# Altium schematic sheet Test_board_gotta_be_quick.SchDoc (part 1 of 2)
size A3; Organization: Altium Limited; Address1: L3, 12a Rodborough Rd; Address2: Frenchs Forest; Address3: NSW; Address4: Australia 2086
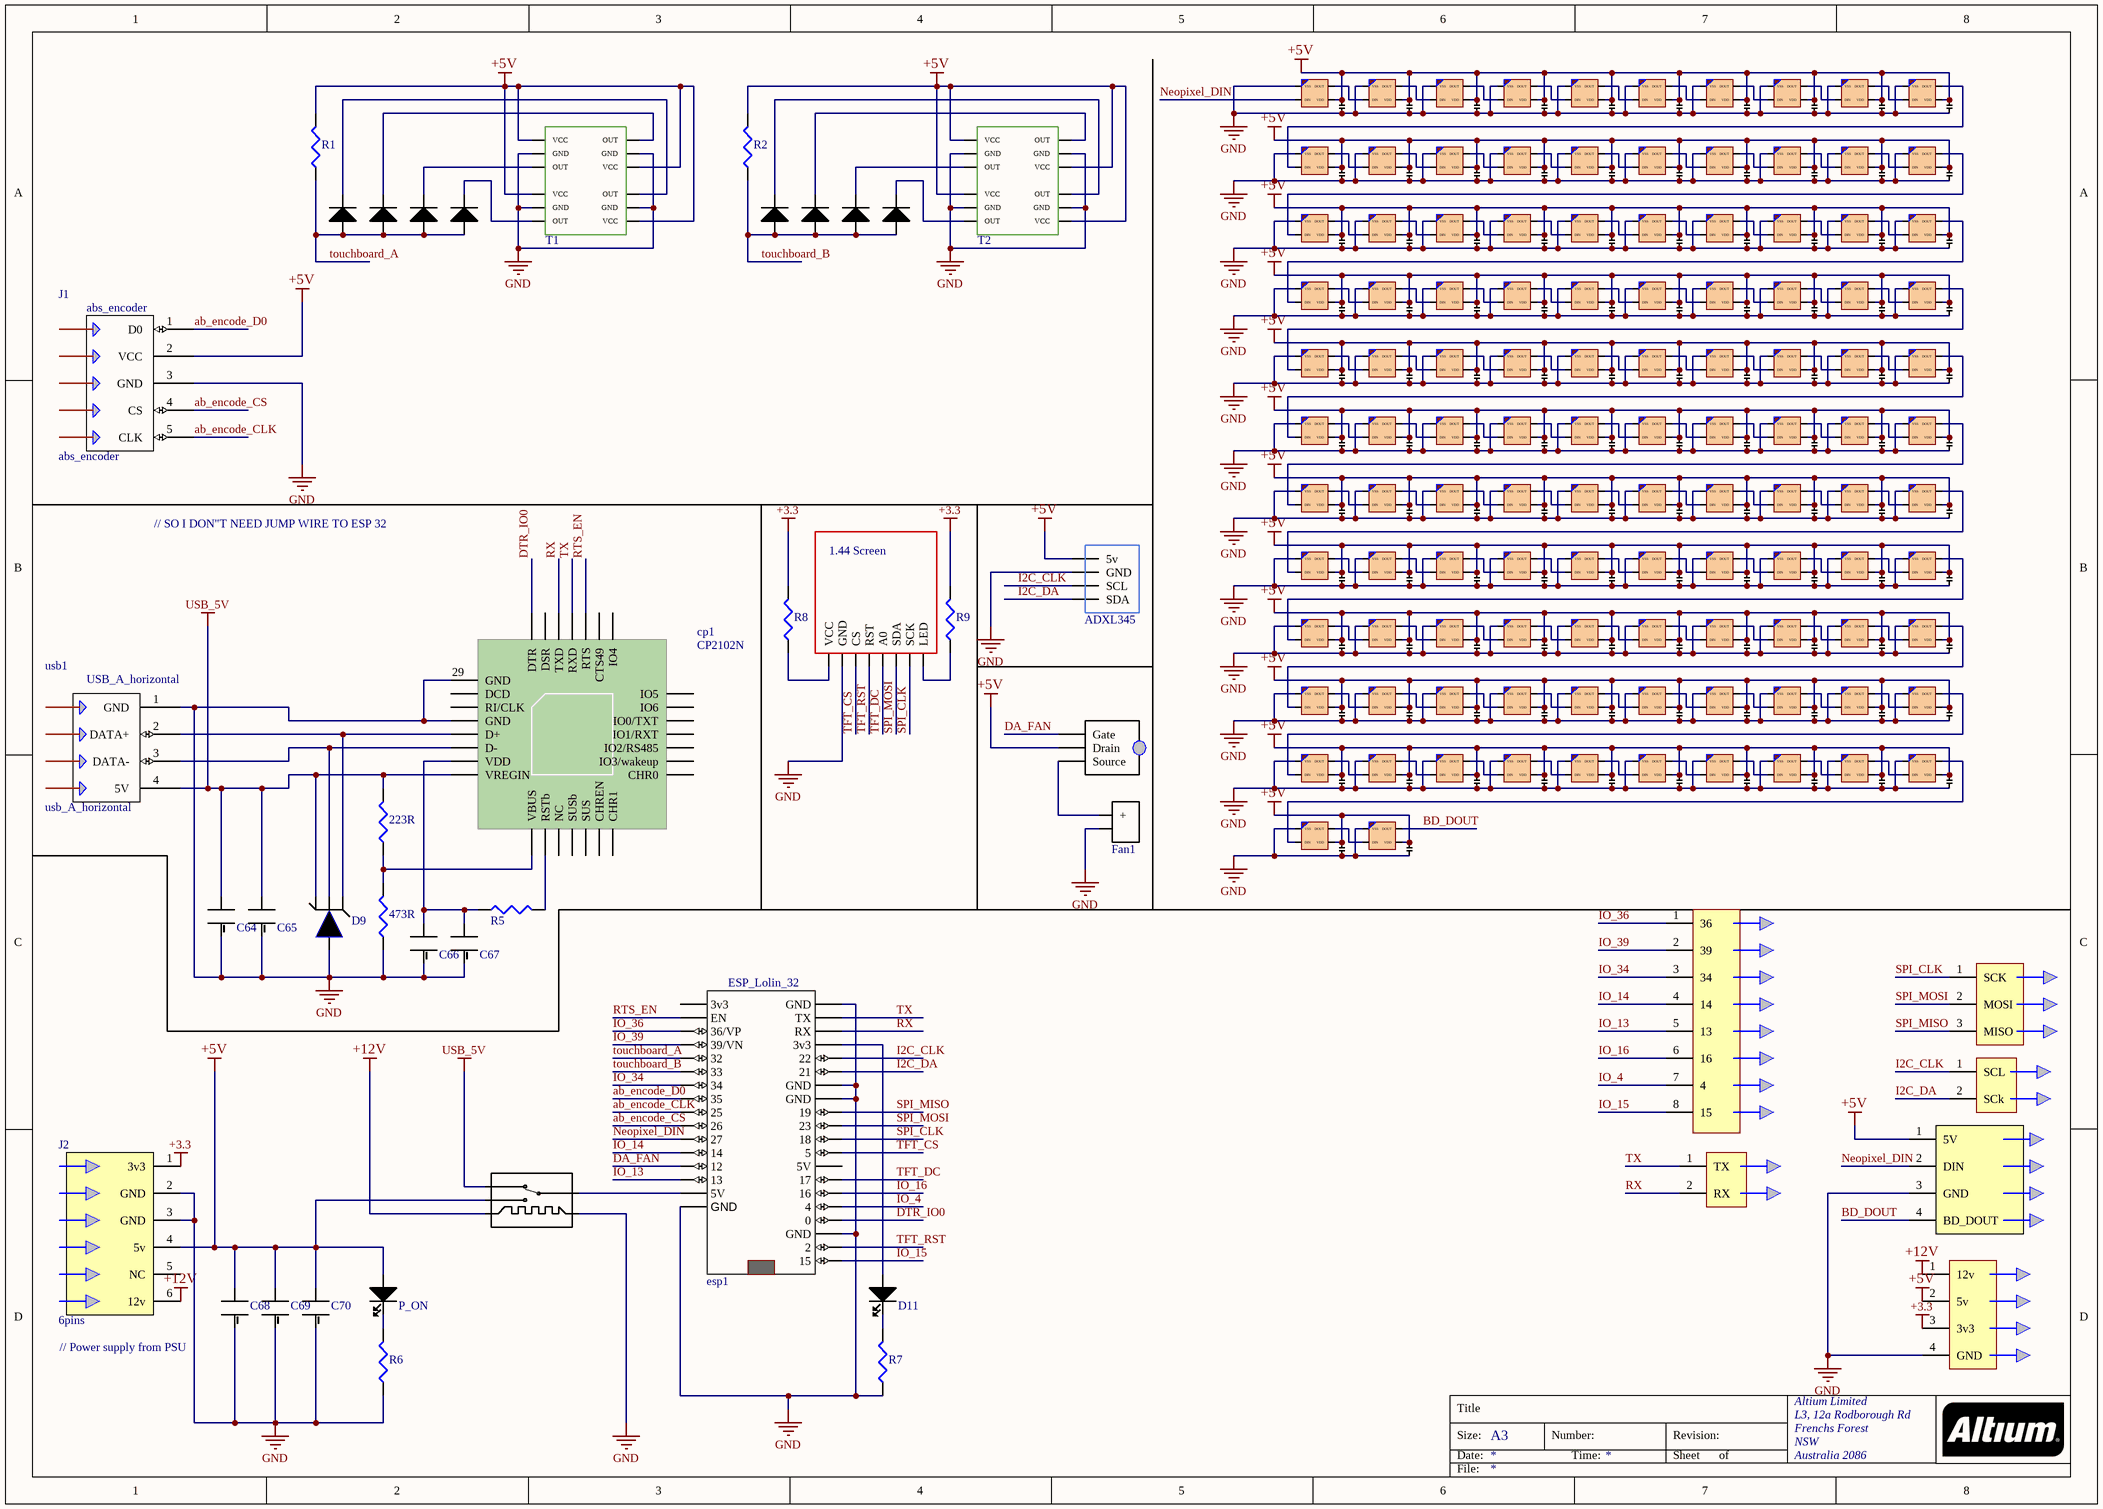
[diagram p0: Test_board_gotta_be_quick.SchDoc]

## Parts
223R  22.1k  [R0805]  (value not drawn)
473R  47.5k  [R0805]  (value not drawn)
ADXL345  ADXL345  [ADXL345]  (value not drawn)
C1  capacitor0.1uf  [Capacitor0805]  (value not drawn)
C2  capacitor0.1uf  [Capacitor0805]  (value not drawn)
C3  capacitor0.1uf  [Capacitor0805]  (value not drawn)
C4  capacitor0.1uf  [Capacitor0805]  (value not drawn)
C5  capacitor0.1uf  [Capacitor0805]  (value not drawn)
C6  capacitor0.1uf  [Capacitor0805]  (value not drawn)
C7  capacitor0.1uf  [Capacitor0805]  (value not drawn)
C8  capacitor0.1uf  [Capacitor0805]  (value not drawn)
C9  capacitor0.1uf  [Capacitor0805]  (value not drawn)
C10  capacitor0.1uf  [Capacitor0805]  (value not drawn)
C11  capacitor0.1uf  [Capacitor0805]  (value not drawn)
C12  capacitor0.1uf  [Capacitor0805]  (value not drawn)
C13  capacitor0.1uf  [Capacitor0805]  (value not drawn)
C14  capacitor0.1uf  [Capacitor0805]  (value not drawn)
C15  capacitor0.1uf  [Capacitor0805]  (value not drawn)
C16  capacitor0.1uf  [Capacitor0805]  (value not drawn)
C17  capacitor0.1uf  [Capacitor0805]  (value not drawn)
C18  capacitor0.1uf  [Capacitor0805]  (value not drawn)
C19  capacitor0.1uf  [Capacitor0805]  (value not drawn)
C20  capacitor0.1uf  [Capacitor0805]  (value not drawn)
C21  capacitor0.1uf  [Capacitor0805]  (value not drawn)
C22  capacitor0.1uf  [Capacitor0805]  (value not drawn)
C23  capacitor0.1uf  [Capacitor0805]  (value not drawn)
C24  capacitor0.1uf  [Capacitor0805]  (value not drawn)
C25  capacitor0.1uf  [Capacitor0805]  (value not drawn)
C26  capacitor0.1uf  [Capacitor0805]  (value not drawn)
C27  capacitor0.1uf  [Capacitor0805]  (value not drawn)
C28  capacitor0.1uf  [Capacitor0805]  (value not drawn)
C29  capacitor0.1uf  [Capacitor0805]  (value not drawn)
C30  capacitor0.1uf  [Capacitor0805]  (value not drawn)
C31  capacitor0.1uf  [Capacitor0805]  (value not drawn)
C32  capacitor0.1uf  [Capacitor0805]  (value not drawn)
C33  capacitor0.1uf  [Capacitor0805]  (value not drawn)
C34  capacitor0.1uf  [Capacitor0805]  (value not drawn)
C35  capacitor0.1uf  [Capacitor0805]  (value not drawn)
C36  capacitor0.1uf  [Capacitor0805]  (value not drawn)
C37  capacitor0.1uf  [Capacitor0805]  (value not drawn)
C38  capacitor0.1uf  [Capacitor0805]  (value not drawn)
C39  capacitor0.1uf  [Capacitor0805]  (value not drawn)
C40  capacitor0.1uf  [Capacitor0805]  (value not drawn)
C41  capacitor0.1uf  [Capacitor0805]  (value not drawn)
C42  capacitor0.1uf  [Capacitor0805]  (value not drawn)
C43  capacitor0.1uf  [Capacitor0805]  (value not drawn)
C44  capacitor0.1uf  [Capacitor0805]  (value not drawn)
C45  capacitor0.1uf  [Capacitor0805]  (value not drawn)
C46  capacitor0.1uf  [Capacitor0805]  (value not drawn)
C47  capacitor0.1uf  [Capacitor0805]  (value not drawn)
C48  capacitor0.1uf  [Capacitor0805]  (value not drawn)
C49  capacitor0.1uf  [Capacitor0805]  (value not drawn)
C50  capacitor0.1uf  [Capacitor0805]  (value not drawn)
C51  capacitor0.1uf  [Capacitor0805]  (value not drawn)
C52  capacitor0.1uf  [Capacitor0805]  (value not drawn)
C53  capacitor0.1uf  [Capacitor0805]  (value not drawn)
C54  capacitor0.1uf  [Capacitor0805]  (value not drawn)
C55  capacitor0.1uf  [Capacitor0805]  (value not drawn)
C56  capacitor0.1uf  [Capacitor0805]  (value not drawn)
C57  capacitor0.1uf  [Capacitor0805]  (value not drawn)
C58  capacitor0.1uf  [Capacitor0805]  (value not drawn)
C59  capacitor0.1uf  [Capacitor0805]  (value not drawn)
C60  capacitor0.1uf  [Capacitor0805]  (value not drawn)
C61  capacitor0.1uf  [Capacitor0805]  (value not drawn)
C62  capacitor0.1uf  [Capacitor0805]  (value not drawn)
C63  capacitor0.1uf  [Capacitor0805]  (value not drawn)
C64  4R7  [Capacitor0603]  (value not drawn)
C65  104  [Capacitor0603]  (value not drawn)
C66  104  [Capacitor0603]  (value not drawn)
C67  4R7  [Capacitor0603]  (value not drawn)
C68  EEU-FM0J331  [2.5mmCapacitor]  (value not drawn)
C69  EEU-FM0J331  [2.5mmCapacitor]  (value not drawn)
C70  EEU-FM0J331  [2.5mmCapacitor]  (value not drawn)
C71  capacitor0.1uf  [Capacitor0805]  (value not drawn)
C72  capacitor0.1uf  [Capacitor0805]  (value not drawn)
C73  capacitor0.1uf  [Capacitor0805]  (value not drawn)
C74  capacitor0.1uf  [Capacitor0805]  (value not drawn)
C75  capacitor0.1uf  [Capacitor0805]  (value not drawn)
C76  capacitor0.1uf  [Capacitor0805]  (value not drawn)
C77  capacitor0.1uf  [Capacitor0805]  (value not drawn)
C78  capacitor0.1uf  [Capacitor0805]  (value not drawn)
C79  capacitor0.1uf  [Capacitor0805]  (value not drawn)
C80  capacitor0.1uf  [Capacitor0805]  (value not drawn)
C81  capacitor0.1uf  [Capacitor0805]  (value not drawn)
C82  capacitor0.1uf  [Capacitor0805]  (value not drawn)
C83  capacitor0.1uf  [Capacitor0805]  (value not drawn)
C84  capacitor0.1uf  [Capacitor0805]  (value not drawn)
C85  capacitor0.1uf  [Capacitor0805]  (value not drawn)
C86  capacitor0.1uf  [Capacitor0805]  (value not drawn)
C87  capacitor0.1uf  [Capacitor0805]  (value not drawn)
C88  capacitor0.1uf  [Capacitor0805]  (value not drawn)
C89  capacitor0.1uf  [Capacitor0805]  (value not drawn)
C90  capacitor0.1uf  [Capacitor0805]  (value not drawn)
C91  capacitor0.1uf  [Capacitor0805]  (value not drawn)
C92  capacitor0.1uf  [Capacitor0805]  (value not drawn)
C93  capacitor0.1uf  [Capacitor0805]  (value not drawn)
C94  capacitor0.1uf  [Capacitor0805]  (value not drawn)
C95  capacitor0.1uf  [Capacitor0805]  (value not drawn)
C96  capacitor0.1uf  [Capacitor0805]  (value not drawn)
C97  capacitor0.1uf  [Capacitor0805]  (value not drawn)
C98  capacitor0.1uf  [Capacitor0805]  (value not drawn)
C99  capacitor0.1uf  [Capacitor0805]  (value not drawn)
C100  capacitor0.1uf  [Capacitor0805]  (value not drawn)
C101  capacitor0.1uf  [Capacitor0805]  (value not drawn)
C102  capacitor0.1uf  [Capacitor0805]  (value not drawn)
C103  capacitor0.1uf  [Capacitor0805]  (value not drawn)
C104  capacitor0.1uf  [Capacitor0805]  (value not drawn)
C105  capacitor0.1uf  [Capacitor0805]  (value not drawn)
C106  capacitor0.1uf  [Capacitor0805]  (value not drawn)
C107  capacitor0.1uf  [Capacitor0805]  (value not drawn)
C108  capacitor0.1uf  [Capacitor0805]  (value not drawn)
C109  capacitor0.1uf  [Capacitor0805]  (value not drawn)
C110  capacitor0.1uf  [Capacitor0805]  (value not drawn)
C111  capacitor0.1uf  [Capacitor0805]  (value not drawn)
C112  capacitor0.1uf  [Capacitor0805]  (value not drawn)
C113  capacitor0.1uf  [Capacitor0805]  (value not drawn)
C114  capacitor0.1uf  [Capacitor0805]  (value not drawn)
C115  capacitor0.1uf  [Capacitor0805]  (value not drawn)
C116  capacitor0.1uf  [Capacitor0805]  (value not drawn)
C117  capacitor0.1uf  [Capacitor0805]  (value not drawn)
C118  capacitor0.1uf  [Capacitor0805]  (value not drawn)
C119  capacitor0.1uf  [Capacitor0805]  (value not drawn)
cp1  CP2102N  [CP2102N_QFN28]
D1  LL4148  [SOD80-LL4148]  (value not drawn)
D2  LL4148  [SOD80-LL4148]  (value not drawn)
D3  LL4148  [SOD80-LL4148]  (value not drawn)
D4  LL4148  [SOD80-LL4148]  (value not drawn)
D5  LL4148  [SOD80-LL4148]  (value not drawn)
D6  LL4148  [SOD80-LL4148]  (value not drawn)
D7  LL4148  [SOD80-LL4148]  (value not drawn)
D8  LL4148  [SOD80-LL4148]  (value not drawn)
D9  SP0503BAHTG  [SP0503BAHTG - SOT143-4]  (value not drawn)
D11  esp_on  [LED0603]  (value not drawn)
esp1  processor  [ESP_32_socket]  (value not drawn)
Fan1  5vFanPin  [1x2 dupont]  (value not drawn)
irl  IRL3713  [TO_220]  (value not drawn)
J1  abs_encoder  [xh 2.54 5 pin]
J2  6pins  [4.2mm 6pin power connector]
J3  ws2812  [1x4 DUPONT]  (value not drawn)
J4  SPI  [1x3 DUPONT]  (value not drawn)
J5  I2C  [1x2 dupont]  (value not drawn)
J6  1x8 dupont io pins  [1x8 dupont]  (value not drawn)
J7  1x4 dupont power  [1x4 DUPONT]  (value not drawn)
J8  TX  [1x2 dupont]  (value not drawn)
LED1  Ws2812B  [ws2812b]  (value not drawn)
LED2  Ws2812B  [ws2812b]  (value not drawn)
LED3  Ws2812B  [ws2812b]  (value not drawn)
LED4  Ws2812B  [ws2812b]  (value not drawn)
LED5  Ws2812B  [ws2812b]  (value not drawn)
LED6  Ws2812B  [ws2812b]  (value not drawn)
LED7  Ws2812B  [ws2812b]  (value not drawn)
LED8  Ws2812B  [ws2812b]  (value not drawn)
LED9  Ws2812B  [ws2812b]  (value not drawn)
LED10  Ws2812B  [ws2812b]  (value not drawn)
LED11  Ws2812B  [ws2812b]  (value not drawn)
LED12  Ws2812B  [ws2812b]  (value not drawn)
LED13  Ws2812B  [ws2812b]  (value not drawn)
LED14  Ws2812B  [ws2812b]  (value not drawn)
LED15  Ws2812B  [ws2812b]  (value not drawn)
LED16  Ws2812B  [ws2812b]  (value not drawn)
LED17  Ws2812B  [ws2812b]  (value not drawn)
LED18  Ws2812B  [ws2812b]  (value not drawn)
LED19  Ws2812B  [ws2812b]  (value not drawn)
LED20  Ws2812B  [ws2812b]  (value not drawn)
LED21  Ws2812B  [ws2812b]  (value not drawn)
LED22  Ws2812B  [ws2812b]  (value not drawn)
LED23  Ws2812B  [ws2812b]  (value not drawn)
LED24  Ws2812B  [ws2812b]  (value not drawn)
LED25  Ws2812B  [ws2812b]  (value not drawn)
LED26  Ws2812B  [ws2812b]  (value not drawn)
LED27  Ws2812B  [ws2812b]  (value not drawn)
LED28  Ws2812B  [ws2812b]  (value not drawn)
LED29  Ws2812B  [ws2812b]  (value not drawn)
LED30  Ws2812B  [ws2812b]  (value not drawn)
LED31  Ws2812B  [ws2812b]  (value not drawn)
LED32  Ws2812B  [ws2812b]  (value not drawn)
LED33  Ws2812B  [ws2812b]  (value not drawn)
LED34  Ws2812B  [ws2812b]  (value not drawn)
LED35  Ws2812B  [ws2812b]  (value not drawn)
LED36  Ws2812B  [ws2812b]  (value not drawn)
LED37  Ws2812B  [ws2812b]  (value not drawn)
LED38  Ws2812B  [ws2812b]  (value not drawn)
LED39  Ws2812B  [ws2812b]  (value not drawn)
LED40  Ws2812B  [ws2812b]  (value not drawn)
LED41  Ws2812B  [ws2812b]  (value not drawn)
LED42  Ws2812B  [ws2812b]  (value not drawn)
LED43  Ws2812B  [ws2812b]  (value not drawn)
LED44  Ws2812B  [ws2812b]  (value not drawn)
LED45  Ws2812B  [ws2812b]  (value not drawn)
LED46  Ws2812B  [ws2812b]  (value not drawn)
LED47  Ws2812B  [ws2812b]  (value not drawn)
LED48  Ws2812B  [ws2812b]  (value not drawn)
LED49  Ws2812B  [ws2812b]  (value not drawn)
LED50  Ws2812B  [ws2812b]  (value not drawn)
LED51  Ws2812B  [ws2812b]  (value not drawn)
LED52  Ws2812B  [ws2812b]  (value not drawn)
LED53  Ws2812B  [ws2812b]  (value not drawn)
LED54  Ws2812B  [ws2812b]  (value not drawn)
LED55  Ws2812B  [ws2812b]  (value not drawn)
LED56  Ws2812B  [ws2812b]  (value not drawn)
LED57  Ws2812B  [ws2812b]  (value not drawn)
LED58  Ws2812B  [ws2812b]  (value not drawn)
LED59  Ws2812B  [ws2812b]  (value not drawn)
LED60  Ws2812B  [ws2812b]  (value not drawn)
LED61  Ws2812B  [ws2812b]  (value not drawn)
LED62  Ws2812B  [ws2812b]  (value not drawn)
LED63  Ws2812B  [ws2812b]  (value not drawn)
LED64  Ws2812B  [ws2812b]  (value not drawn)
LED65  Ws2812B  [ws2812b]  (value not drawn)
LED66  Ws2812B  [ws2812b]  (value not drawn)
LED67  Ws2812B  [ws2812b]  (value not drawn)
LED68  Ws2812B  [ws2812b]  (value not drawn)
LED69  Ws2812B  [ws2812b]  (value not drawn)
LED70  Ws2812B  [ws2812b]  (value not drawn)
LED71  Ws2812B  [ws2812b]  (value not drawn)
LED72  Ws2812B  [ws2812b]  (value not drawn)
LED73  Ws2812B  [ws2812b]  (value not drawn)
LED74  Ws2812B  [ws2812b]  (value not drawn)
LED75  Ws2812B  [ws2812b]  (value not drawn)
LED76  Ws2812B  [ws2812b]  (value not drawn)
LED77  Ws2812B  [ws2812b]  (value not drawn)
LED78  Ws2812B  [ws2812b]  (value not drawn)
LED79  Ws2812B  [ws2812b]  (value not drawn)
LED80  Ws2812B  [ws2812b]  (value not drawn)
LED81  Ws2812B  [ws2812b]  (value not drawn)
LED82  Ws2812B  [ws2812b]  (value not drawn)
LED83  Ws2812B  [ws2812b]  (value not drawn)
LED84  Ws2812B  [ws2812b]  (value not drawn)
LED85  Ws2812B  [ws2812b]  (value not drawn)
LED86  Ws2812B  [ws2812b]  (value not drawn)
LED87  Ws2812B  [ws2812b]  (value not drawn)
LED88  Ws2812B  [ws2812b]  (value not drawn)
LED89  Ws2812B  [ws2812b]  (value not drawn)
LED90  Ws2812B  [ws2812b]  (value not drawn)
LED91  Ws2812B  [ws2812b]  (value not drawn)
LED92  Ws2812B  [ws2812b]  (value not drawn)
LED93  Ws2812B  [ws2812b]  (value not drawn)
LED94  Ws2812B  [ws2812b]  (value not drawn)
LED95  Ws2812B  [ws2812b]  (value not drawn)
LED96  Ws2812B  [ws2812b]  (value not drawn)
LED97  Ws2812B  [ws2812b]  (value not drawn)
LED98  Ws2812B  [ws2812b]  (value not drawn)
LED99  Ws2812B  [ws2812b]  (value not drawn)
LED100  Ws2812B  [ws2812b]  (value not drawn)
LED101  Ws2812B  [ws2812b]  (value not drawn)
LED102  Ws2812B  [ws2812b]  (value not drawn)
LED103  Ws2812B  [ws2812b]  (value not drawn)
LED104  Ws2812B  [ws2812b]  (value not drawn)
LED105  Ws2812B  [ws2812b]  (value not drawn)
LED106  Ws2812B  [ws2812b]  (value not drawn)
LED107  Ws2812B  [ws2812b]  (value not drawn)
LED108  Ws2812B  [ws2812b]  (value not drawn)
LED109  Ws2812B  [ws2812b]  (value not drawn)
LED110  Ws2812B  [ws2812b]  (value not drawn)
LED111  Ws2812B  [ws2812b]  (value not drawn)
LED112  Ws2812B  [ws2812b]  (value not drawn)
P_ON  Led  [LED0603]  (value not drawn)
R1  102R  [R0805]  (value not drawn)
R2  102R  [R0805]  (value not drawn)
R5  102R  [R0805]  (value not drawn)
R6  360R  [R0805]  (value not drawn)
R7  360R  [R0805]  (value not drawn)
R8  0R_or_360R  [R0805]  (value not drawn)
R9  0R_or_360R  [R0805]  (value not drawn)
Relay1  LM1H-12D  [Relay LM1H-12D]  (value not drawn)
Screen  1.44 Screen  [1.44TFT Screen]
T1  Touch_pads2x2  [TouchBoard2x2]  (value not drawn)
T2  Touch_pads2x2  [TouchBoard2x2]  (value not drawn)
usb1  usb_A_horizontal  [HORIZONTAL_USB_A_MALE_SOCKET]

## Nets
+3.3: J2.1(3v3) J7.3(3v3) R8.2 R9.2
+5V: ADXL345.1(5v) C1.2(+) C2.2(+) C3.2(+) C4.2(+) C5.2(+) C6.2(+) C7.2(+) C8.2(+) C9.2(+) C10.2(+) C11.2(+) C12.2(+) C13.2(+) C14.2(+) C15.2(+) C16.2(+) C17.2(+) C18.2(+) C19.2(+) C20.2(+) C21.2(+) C22.2(+) C23.2(+) C24.2(+) C25.2(+) C26.2(+) C27.2(+) C28.2(+) C29.2(+) C30.2(+) C31.2(+) C32.2(+) C33.2(+) C34.2(+) C35.2(+) C36.2(+) C37.2(+) C38.2(+) C39.2(+) C40.2(+) C41.2(+) C42.2(+) C43.2(+) C44.2(+) C45.2(+) C46.2(+) C47.2(+) C48.2(+) C49.2(+) C50.2(+) C51.2(+) C52.2(+) C53.2(+) C54.2(+) C55.2(+) C56.2(+) C57.2(+) C58.2(+) C59.2(+) C60.2(+) C61.2(+) C62.2(+) C63.2(+) C68.2(+) C69.2(+) C70.2(+) C71.2(+) C72.2(+) C73.2(+) C74.2(+) C75.2(+) C76.2(+) C77.2(+) C78.2(+) C79.2(+) C80.2(+) C81.2(+) C82.2(+) C83.2(+) C84.2(+) C85.2(+) C86.2(+) C87.2(+) C88.2(+) C89.2(+) C90.2(+) C91.2(+) C92.2(+) C93.2(+) C94.2(+) C95.2(+) C96.2(+) C97.2(+) C98.2(+) C99.2(+) C100.2(+) C101.2(+) C102.2(+) C103.2(+) C104.2(+) C105.2(+) C106.2(+) C107.2(+) C108.2(+) C109.2(+) C110.2(+) C111.2(+) C112.2(+) C113.2(+) C114.2(+) C115.2(+) C116.2(+) C117.2(+) C118.2(+) C119.2(+) irl.2(Drain) J1.2(VCC) J2.4(5v) J3.1(5V) J7.2(5v) LED1.1(VDD) LED2.1(VDD) LED3.1(VDD) LED4.1(VDD) LED5.1(VDD) LED6.1(VDD) LED7.1(VDD) LED8.1(VDD) LED9.1(VDD) LED10.1(VDD) LED11.1(VDD) LED12.1(VDD) LED13.1(VDD) LED14.1(VDD) LED15.1(VDD) LED16.1(VDD) LED17.1(VDD) LED18.1(VDD) LED19.1(VDD) LED20.1(VDD) LED21.1(VDD) LED22.1(VDD) LED23.1(VDD) LED24.1(VDD) LED25.1(VDD) LED26.1(VDD) LED27.1(VDD) LED28.1(VDD) LED29.1(VDD) LED30.1(VDD) LED31.1(VDD) LED32.1(VDD) LED33.1(VDD) LED34.1(VDD) LED35.1(VDD) LED36.1(VDD) LED37.1(VDD) LED38.1(VDD) LED39.1(VDD) LED40.1(VDD) LED41.1(VDD) LED42.1(VDD) LED43.1(VDD) LED44.1(VDD) LED45.1(VDD) LED46.1(VDD) LED47.1(VDD) LED48.1(VDD) LED49.1(VDD) LED50.1(VDD) LED51.1(VDD) LED52.1(VDD) LED53.1(VDD) LED54.1(VDD) LED55.1(VDD) LED56.1(VDD) LED57.1(VDD) LED58.1(VDD) LED59.1(VDD) LED60.1(VDD) LED61.1(VDD) LED62.1(VDD) LED63.1(VDD) LED64.1(VDD) LED65.1(VDD) LED66.1(VDD) LED67.1(VDD) LED68.1(VDD) LED69.1(VDD) LED70.1(VDD) LED71.1(VDD) LED72.1(VDD) LED73.1(VDD) LED74.1(VDD) LED75.1(VDD) LED76.1(VDD) LED77.1(VDD) LED78.1(VDD) LED79.1(VDD) LED80.1(VDD) LED81.1(VDD) LED82.1(VDD) LED83.1(VDD) LED84.1(VDD) LED85.1(VDD) LED86.1(VDD) LED87.1(VDD) LED88.1(VDD) LED89.1(VDD) LED90.1(VDD) LED91.1(VDD) LED92.1(VDD) LED93.1(VDD) LED94.1(VDD) LED95.1(VDD) LED96.1(VDD) LED97.1(VDD) LED98.1(VDD) LED99.1(VDD) LED100.1(VDD) LED101.1(VDD) LED102.1(VDD) LED103.1(VDD) LED104.1(VDD) LED105.1(VDD) LED106.1(VDD) LED107.1(VDD) LED108.1(VDD) LED109.1(VDD) LED110.1(VDD) LED111.1(VDD) LED112.1(VDD) P_ON.2 R1.2 R2.2 Relay1.4(NO) T1.1(VCC) T1.4(VCC) T1.7(VCC) T1.10(VCC) T2.1(VCC) T2.4(VCC) T2.7(VCC) T2.10(VCC)
+12V: J2.6(12v) J7.1(12v) Relay1.1(Coli_A)
GND: 473R.1 ADXL345.2(GND) C1.1(-) C2.1(-) C3.1(-) C4.1(-) C5.1(-) C6.1(-) C7.1(-) C8.1(-) C9.1(-) C10.1(-) C11.1(-) C12.1(-) C13.1(-) C14.1(-) C15.1(-) C16.1(-) C17.1(-) C18.1(-) C19.1(-) C20.1(-) C21.1(-) C22.1(-) C23.1(-) C24.1(-) C25.1(-) C26.1(-) C27.1(-) C28.1(-) C29.1(-) C30.1(-) C31.1(-) C32.1(-) C33.1(-) C34.1(-) C35.1(-) C36.1(-) C37.1(-) C38.1(-) C39.1(-) C40.1(-) C41.1(-) C42.1(-) C43.1(-) C44.1(-) C45.1(-) C46.1(-) C47.1(-) C48.1(-) C49.1(-) C50.1(-) C51.1(-) C52.1(-) C53.1(-) C54.1(-) C55.1(-) C56.1(-) C57.1(-) C58.1(-) C59.1(-) C60.1(-) C61.1(-) C62.1(-) C63.1(-) C64.1(-) C65.1(-) C66.1(-) C67.1(-) C68.1(-) C69.1(-) C70.1(-) C71.1(-) C72.1(-) C73.1(-) C74.1(-) C75.1(-) C76.1(-) C77.1(-) C78.1(-) C79.1(-) C80.1(-) C81.1(-) C82.1(-) C83.1(-) C84.1(-) C85.1(-) C86.1(-) C87.1(-) C88.1(-) C89.1(-) C90.1(-) C91.1(-) C92.1(-) C93.1(-) C94.1(-) C95.1(-) C96.1(-) C97.1(-) C98.1(-) C99.1(-) C100.1(-) C101.1(-) C102.1(-) C103.1(-) C104.1(-) C105.1(-) C106.1(-) C107.1(-) C108.1(-) C109.1(-) C110.1(-) C111.1(-) C112.1(-) C113.1(-) C114.1(-) C115.1(-) C116.1(-) C117.1(-) C118.1(-) C119.1(-) cp1.3(GND) cp1.29(GND) D9.1(+) esp1.1(GND) esp1.7(GND) esp1.8(GND) esp1.18(GND) esp1.36(GND) Fan1.2(-) J1.3(GND) J2.2(GND) J2.3(GND) J3.3(GND) J7.4(GND) LED1.3(VSS) LED2.3(VSS) LED3.3(VSS) LED4.3(VSS) LED5.3(VSS) LED6.3(VSS) LED7.3(VSS) LED8.3(VSS) LED9.3(VSS) LED10.3(VSS) LED11.3(VSS) LED12.3(VSS) LED13.3(VSS) LED14.3(VSS) LED15.3(VSS) LED16.3(VSS) LED17.3(VSS) LED18.3(VSS) LED19.3(VSS) LED20.3(VSS) LED21.3(VSS) LED22.3(VSS) LED23.3(VSS) LED24.3(VSS) LED25.3(VSS) LED26.3(VSS) LED27.3(VSS) LED28.3(VSS) LED29.3(VSS) LED30.3(VSS) LED31.3(VSS) LED32.3(VSS) LED33.3(VSS) LED34.3(VSS) LED35.3(VSS) LED36.3(VSS) LED37.3(VSS) LED38.3(VSS) LED39.3(VSS) LED40.3(VSS) LED41.3(VSS) LED42.3(VSS) LED43.3(VSS) LED44.3(VSS) LED45.3(VSS) LED46.3(VSS) LED47.3(VSS) LED48.3(VSS) LED49.3(VSS) LED50.3(VSS) LED51.3(VSS) LED52.3(VSS) LED53.3(VSS) LED54.3(VSS) LED55.3(VSS) LED56.3(VSS) LED57.3(VSS) LED58.3(VSS) LED59.3(VSS) LED60.3(VSS) LED61.3(VSS) LED62.3(VSS) LED63.3(VSS) LED64.3(VSS) LED65.3(VSS) LED66.3(VSS) LED67.3(VSS) LED68.3(VSS) LED69.3(VSS) LED70.3(VSS) LED71.3(VSS) LED72.3(VSS) LED73.3(VSS) LED74.3(VSS) LED75.3(VSS) LED76.3(VSS) LED77.3(VSS) LED78.3(VSS) LED79.3(VSS) LED80.3(VSS) LED81.3(VSS) LED82.3(VSS) LED83.3(VSS) LED84.3(VSS) LED85.3(VSS) LED86.3(VSS) LED87.3(VSS) LED88.3(VSS) LED89.3(VSS) LED90.3(VSS) LED91.3(VSS) LED92.3(VSS) LED93.3(VSS) LED94.3(VSS) LED95.3(VSS) LED96.3(VSS) LED97.3(VSS) LED98.3(VSS) LED99.3(VSS) LED100.3(VSS) LED101.3(VSS) LED102.3(VSS) LED103.3(VSS) LED104.3(VSS) LED105.3(VSS) LED106.3(VSS) LED107.3(VSS) LED108.3(VSS) LED109.3(VSS) LED110.3(VSS) LED111.3(VSS) LED112.3(VSS) R6.1 R7.1 Relay1.2(Coli_B) Screen.2(GND) T1.2(GND) T1.5(GND) T1.8(GND) T1.11(GND) T2.2(GND) T2.5(GND) T2.8(GND) T2.11(GND) usb1.1(GND)
USB_5V: 223R.2 C64.2(+) C65.2(+) cp1.7(VREGIN) D9.4 Relay1.5(NC) usb1.4(5V)
ab_encode_CLK: esp1.29(25) J1.5(CLK)
ab_encode_CS: esp1.30(26) J1.4(CS)
ab_encode_D0: esp1.28(35) J1.1(D0)
BD_DOUT: J3.4(BD_DOUT) LED112.2(DOUT)
DA_FAN: esp1.33(12) irl.1(Gate)
DTR_IO0: cp1.28(DTR) esp1.17(0)
I2C_CLK: ADXL345.3(SCL) esp1.5(22) J5.1(SCL)
I2C_DA: ADXL345.4(SDA) esp1.6(21) J5.2(SCk)
IO_4: esp1.16(4) J6.7(4)
IO_13: esp1.34(13) J6.5(13)
IO_14: esp1.32(14) J6.4(14)
IO_15: esp1.20(15) J6.8(15)
IO_16: esp1.15(16) J6.6(16)
IO_34: esp1.27(34) J6.3(34)
IO_36: esp1.23(36/VP) J6.1(36)
IO_39: esp1.24(39/VN) J6.2(39)
Neopixel_DIN: esp1.31(27) J3.2(DIN) LED1.4(DIN)
RTS_EN: cp1.24(RTS) esp1.22(EN)
RX: cp1.26(TXD) esp1.3(RX) J8.2(RX)
SPI_CLK: esp1.11(18) J4.1(SCK) Screen.7(SCK)
SPI_MISO: esp1.9(19) J4.3(MISO)
SPI_MOSI: esp1.10(23) J4.2(MOSI) Screen.6(SDA)
TFT_CS: esp1.12(5) Screen.3(CS)
TFT_DC: esp1.14(17) Screen.5(A0)
TFT_RST: esp1.19(2) Screen.4(RST)
touchboard_A: D1.2 D2.2 D3.2 D4.2 esp1.25(32) R1.1
touchboard_B: D5.2 D6.2 D7.2 D8.2 esp1.26(33) R2.1
TX: cp1.25(RXD) esp1.2(TX) J8.1(TX)
Net223R_1: 223R.1 473R.2 cp1.8(VBUS)
NetC66_2: C66.2(+) C67.2(+) cp1.6(VDD) R5.1
Netcp1_4: cp1.4(D+) D9.2 usb1.2(DATA+)
Netcp1_5: cp1.5(D-) D9.3 usb1.3(DATA-)
Netcp1_9: cp1.9(RSTb) R5.2
NetD1_1: D1.1 T1.9(OUT)
NetD2_1: D2.1 T1.12(OUT)
NetD3_1: D3.1 T1.3(OUT)
NetD4_1: D4.1 T1.6(OUT)
NetD5_1: D5.1 T2.9(OUT)
NetD6_1: D6.1 T2.12(OUT)
NetD7_1: D7.1 T2.3(OUT)
NetD8_1: D8.1 T2.6(OUT)
NetD11_1: D11.1 R7.2
NetD11_2: D11.2 esp1.4(3v3)
Netesp1_35: esp1.35(5V) Relay1.3(COM)
NetFan1_1: Fan1.1(+) irl.3(Source)
NetLED1_2: LED1.2(DOUT) LED2.4(DIN)
NetLED2_2: LED2.2(DOUT) LED3.4(DIN)
NetLED3_2: LED3.2(DOUT) LED4.4(DIN)
NetLED4_2: LED4.2(DOUT) LED5.4(DIN)
NetLED5_2: LED5.2(DOUT) LED6.4(DIN)
NetLED6_2: LED6.2(DOUT) LED7.4(DIN)
NetLED7_2: LED7.2(DOUT) LED8.4(DIN)
NetLED8_2: LED8.2(DOUT) LED9.4(DIN)
NetLED9_2: LED9.2(DOUT) LED10.4(DIN)
NetLED10_2: LED10.2(DOUT) LED11.4(DIN)
NetLED11_2: LED11.2(DOUT) LED12.4(DIN)
NetLED12_2: LED12.2(DOUT) LED13.4(DIN)
NetLED13_2: LED13.2(DOUT) LED14.4(DIN)
NetLED14_2: LED14.2(DOUT) LED15.4(DIN)
NetLED15_2: LED15.2(DOUT) LED16.4(DIN)
NetLED16_2: LED16.2(DOUT) LED17.4(DIN)
NetLED17_2: LED17.2(DOUT) LED18.4(DIN)
NetLED18_2: LED18.2(DOUT) LED19.4(DIN)
NetLED19_2: LED19.2(DOUT) LED20.4(DIN)
NetLED20_2: LED20.2(DOUT) LED21.4(DIN)
NetLED21_2: LED21.2(DOUT) LED22.4(DIN)
NetLED22_2: LED22.2(DOUT) LED23.4(DIN)
NetLED23_2: LED23.2(DOUT) LED24.4(DIN)
NetLED24_2: LED24.2(DOUT) LED25.4(DIN)
NetLED25_2: LED25.2(DOUT) LED26.4(DIN)
NetLED26_2: LED26.2(DOUT) LED27.4(DIN)
NetLED27_2: LED27.2(DOUT) LED28.4(DIN)
NetLED28_2: LED28.2(DOUT) LED29.4(DIN)
NetLED29_2: LED29.2(DOUT) LED30.4(DIN)
NetLED30_2: LED30.2(DOUT) LED31.4(DIN)
NetLED31_2: LED31.2(DOUT) LED32.4(DIN)
NetLED32_2: LED32.2(DOUT) LED33.4(DIN)
NetLED33_2: LED33.2(DOUT) LED34.4(DIN)
NetLED34_2: LED34.2(DOUT) LED35.4(DIN)
NetLED35_2: LED35.2(DOUT) LED36.4(DIN)
NetLED36_2: LED36.2(DOUT) LED37.4(DIN)
NetLED37_2: LED37.2(DOUT) LED38.4(DIN)
NetLED38_2: LED38.2(DOUT) LED39.4(DIN)
NetLED39_2: LED39.2(DOUT) LED40.4(DIN)
NetLED40_2: LED40.2(DOUT) LED41.4(DIN)
NetLED41_2: LED41.2(DOUT) LED42.4(DIN)
NetLED42_2: LED42.2(DOUT) LED43.4(DIN)
NetLED43_2: LED43.2(DOUT) LED44.4(DIN)
NetLED44_2: LED44.2(DOUT) LED45.4(DIN)
NetLED45_2: LED45.2(DOUT) LED46.4(DIN)
NetLED46_2: LED46.2(DOUT) LED47.4(DIN)
NetLED47_2: LED47.2(DOUT) LED48.4(DIN)
NetLED48_2: LED48.2(DOUT) LED49.4(DIN)
NetLED49_2: LED49.2(DOUT) LED50.4(DIN)
NetLED50_2: LED50.2(DOUT) LED51.4(DIN)
NetLED51_2: LED51.2(DOUT) LED52.4(DIN)
NetLED52_2: LED52.2(DOUT) LED53.4(DIN)
NetLED53_2: LED53.2(DOUT) LED54.4(DIN)
NetLED54_2: LED54.2(DOUT) LED55.4(DIN)
NetLED55_2: LED55.2(DOUT) LED56.4(DIN)
NetLED56_2: LED56.2(DOUT) LED57.4(DIN)
NetLED57_2: LED57.2(DOUT) LED58.4(DIN)
NetLED58_2: LED58.2(DOUT) LED59.4(DIN)
NetLED59_2: LED59.2(DOUT) LED60.4(DIN)
NetLED60_2: LED60.2(DOUT) LED61.4(DIN)
NetLED61_2: LED61.2(DOUT) LED62.4(DIN)
NetLED62_2: LED62.2(DOUT) LED63.4(DIN)
NetLED63_2: LED63.2(DOUT) LED64.4(DIN)
NetLED64_2: LED64.2(DOUT) LED65.4(DIN)
NetLED65_2: LED65.2(DOUT) LED66.4(DIN)
NetLED66_2: LED66.2(DOUT) LED67.4(DIN)
NetLED67_2: LED67.2(DOUT) LED68.4(DIN)
NetLED68_2: LED68.2(DOUT) LED69.4(DIN)
NetLED69_2: LED69.2(DOUT) LED70.4(DIN)
NetLED70_2: LED70.2(DOUT) LED71.4(DIN)
NetLED71_2: LED71.2(DOUT) LED72.4(DIN)
NetLED72_2: LED72.2(DOUT) LED73.4(DIN)
NetLED73_2: LED73.2(DOUT) LED74.4(DIN)
NetLED74_2: LED74.2(DOUT) LED75.4(DIN)
NetLED75_2: LED75.2(DOUT) LED76.4(DIN)
NetLED76_2: LED76.2(DOUT) LED77.4(DIN)
NetLED77_2: LED77.2(DOUT) LED78.4(DIN)
NetLED78_2: LED78.2(DOUT) LED79.4(DIN)
NetLED79_2: LED79.2(DOUT) LED80.4(DIN)
NetLED80_2: LED80.2(DOUT) LED81.4(DIN)
NetLED81_2: LED81.2(DOUT) LED82.4(DIN)
NetLED82_2: LED82.2(DOUT) LED83.4(DIN)
NetLED83_2: LED83.2(DOUT) LED84.4(DIN)
NetLED84_2: LED84.2(DOUT) LED85.4(DIN)
NetLED85_2: LED85.2(DOUT) LED86.4(DIN)
NetLED86_2: LED86.2(DOUT) LED87.4(DIN)
NetLED87_2: LED87.2(DOUT) LED88.4(DIN)
NetLED88_2: LED88.2(DOUT) LED89.4(DIN)
NetLED89_2: LED89.2(DOUT) LED90.4(DIN)
NetLED90_2: LED90.2(DOUT) LED91.4(DIN)
NetLED91_2: LED91.2(DOUT) LED92.4(DIN)
NetLED92_2: LED92.2(DOUT) LED93.4(DIN)
NetLED93_2: LED93.2(DOUT) LED94.4(DIN)
NetLED94_2: LED94.2(DOUT) LED95.4(DIN)
NetLED95_2: LED95.2(DOUT) LED96.4(DIN)
NetLED96_2: LED96.2(DOUT) LED97.4(DIN)
NetLED97_2: LED97.2(DOUT) LED98.4(DIN)
NetLED98_2: LED98.2(DOUT) LED99.4(DIN)
NetLED99_2: LED99.2(DOUT) LED100.4(DIN)
NetLED100_2: LED100.2(DOUT) LED101.4(DIN)
NetLED101_2: LED101.2(DOUT) LED102.4(DIN)
NetLED102_2: LED102.2(DOUT) LED103.4(DIN)
NetLED103_2: LED103.2(DOUT) LED104.4(DIN)
NetLED104_2: LED104.2(DOUT) LED105.4(DIN)
NetLED105_2: LED105.2(DOUT) LED106.4(DIN)
NetLED106_2: LED106.2(DOUT) LED107.4(DIN)
NetLED107_2: LED107.2(DOUT) LED108.4(DIN)
NetLED108_2: LED108.2(DOUT) LED109.4(DIN)
NetLED109_2: LED109.2(DOUT) LED110.4(DIN)
NetLED110_2: LED110.2(DOUT) LED111.4(DIN)
NetLED111_2: LED111.2(DOUT) LED112.4(DIN)
NetP_ON_1: P_ON.1 R6.2
NetR8_1: R8.1 Screen.1(VCC)
NetR9_1: R9.1 Screen.8(LED)

Not connected (* = marked no-connect by the designer): cp1 1(DCD) 2(RI/CLK) 10(NC) 11(SUSb) 12(SUS) 13(CHREN) 14(CHR1) 15(CHR0) 16(IO3/wakeup) 17(IO2/RS485) 18(IO1/RXT) 19(IO0/TXT) 20(IO6) 21(IO5) 22(IO4) 23(CTS49) 27(DSR); esp1 13(5V) 21(3v3); J2 5(NC)

## Notes on the sheet
- // SO I DON"T NEED JUMP WIRE TO ESP 32
- // Power supply from PSU
- Title
- Size:
- Date:
- A3
- Number:
- Time:
- Revision:
- Sheet
- of
- File:
- (in symbol ESP_32_lolin) ESP_Lolin_32
- (in symbol usb_A_horizontal) USB_A_horizontal